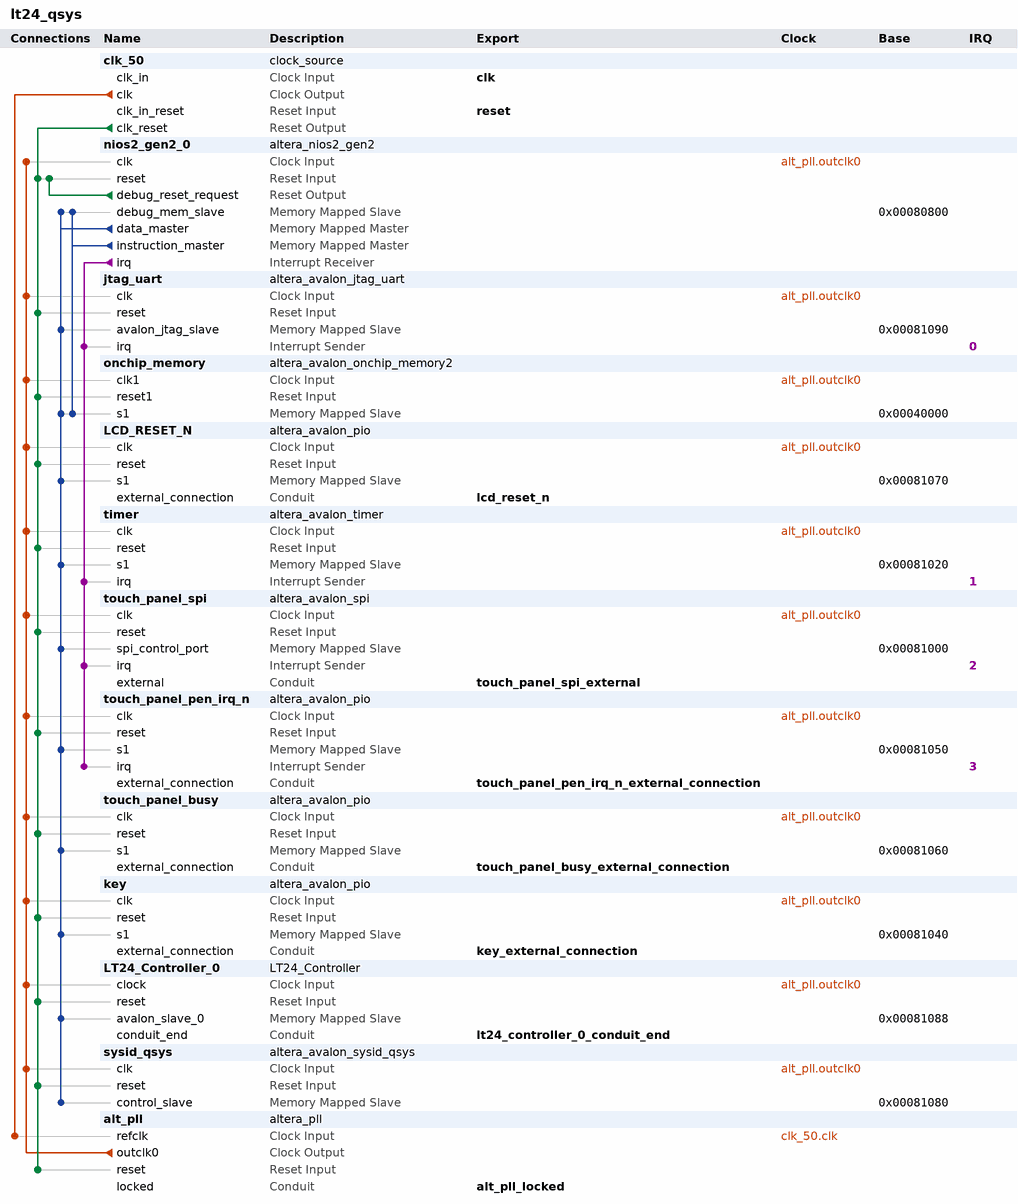
[diagram p0: system contents]
# Platform Designer (Qsys) system lt24_qsys, Cyclone V 5CSEMA4U23C6
# Parameters at their usual value, and those the tool derives, are not listed.
package require -exact qsys 14.1
create_system lt24_qsys
set_project_property DEVICE_FAMILY {Cyclone V}
set_project_property DEVICE 5CSEMA4U23C6

add_instance clk_50 clock_source 14.1
set_instance_parameter_value clk_50 clockFrequency 50000000

add_instance nios2_gen2_0 altera_nios2_gen2 14.1
set_instance_parameter_value nios2_gen2_0 dcache_size 2048
set_instance_parameter_value nios2_gen2_0 exceptionSlave onchip_memory.s1
set_instance_parameter_value nios2_gen2_0 icache_size 4096
set_instance_parameter_value nios2_gen2_0 impl Fast
set_instance_parameter_value nios2_gen2_0 resetSlave onchip_memory.s1

add_instance jtag_uart altera_avalon_jtag_uart 14.1
set_instance_parameter_value jtag_uart simInteractiveOptions INTERACTIVE_ASCII_OUTPUT

add_instance onchip_memory altera_avalon_onchip_memory2 14.1
set_instance_parameter_value onchip_memory dataWidth 32
set_instance_parameter_value onchip_memory dualPort false
set_instance_parameter_value onchip_memory initMemContent true
set_instance_parameter_value onchip_memory initializationFileName onchip_memory
set_instance_parameter_value onchip_memory memorySize 220000

add_instance LCD_RESET_N altera_avalon_pio 14.1
set_instance_parameter_value LCD_RESET_N direction Output
set_instance_parameter_value LCD_RESET_N width 1

add_instance timer altera_avalon_timer 14.1
set_instance_parameter_value timer period 1
set_instance_parameter_value timer periodUnits MSEC

add_instance touch_panel_spi altera_avalon_spi 14.1
set_instance_parameter_value touch_panel_spi clockPolarity 0
set_instance_parameter_value touch_panel_spi dataWidth 8
set_instance_parameter_value touch_panel_spi masterSPI true
set_instance_parameter_value touch_panel_spi numberOfSlaves 1
set_instance_parameter_value touch_panel_spi targetClockRate 32000

add_instance touch_panel_pen_irq_n altera_avalon_pio 14.1
set_instance_parameter_value touch_panel_pen_irq_n captureEdge true
set_instance_parameter_value touch_panel_pen_irq_n direction Input
set_instance_parameter_value touch_panel_pen_irq_n edgeType FALLING
set_instance_parameter_value touch_panel_pen_irq_n generateIRQ true
set_instance_parameter_value touch_panel_pen_irq_n irqType EDGE
set_instance_parameter_value touch_panel_pen_irq_n width 1

add_instance touch_panel_busy altera_avalon_pio 14.1
set_instance_parameter_value touch_panel_busy direction Input
set_instance_parameter_value touch_panel_busy width 1

add_instance key altera_avalon_pio 14.1
set_instance_parameter_value key direction Input
set_instance_parameter_value key width 4

add_instance LT24_Controller_0 LT24_Controller 1.0

add_instance sysid_qsys altera_avalon_sysid_qsys 14.1
set_instance_parameter_value sysid_qsys id 0

add_instance alt_pll altera_pll 14.1
set_instance_parameter_value alt_pll gui_device_speed_grade 2
set_instance_parameter_value alt_pll gui_number_of_clocks 1
set_instance_parameter_value alt_pll gui_operation_mode normal
set_instance_parameter_value alt_pll gui_output_clock_frequency0 150.0
set_instance_parameter_value alt_pll gui_pll_mode {Integer-N PLL}
set_instance_parameter_value alt_pll gui_reference_clock_frequency 50.0
set_instance_parameter_value alt_pll gui_use_locked true

# connections
add_connection alt_pll.outclk0 jtag_uart.clk clock
add_connection alt_pll.outclk0 key.clk clock
add_connection alt_pll.outclk0 LCD_RESET_N.clk clock
add_connection alt_pll.outclk0 LT24_Controller_0.clock clock
add_connection alt_pll.outclk0 nios2_gen2_0.clk clock
add_connection alt_pll.outclk0 onchip_memory.clk1 clock
add_connection alt_pll.outclk0 sysid_qsys.clk clock
add_connection alt_pll.outclk0 timer.clk clock
add_connection alt_pll.outclk0 touch_panel_busy.clk clock
add_connection alt_pll.outclk0 touch_panel_pen_irq_n.clk clock
add_connection alt_pll.outclk0 touch_panel_spi.clk clock
add_connection clk_50.clk alt_pll.refclk clock
add_connection clk_50.clk_reset alt_pll.reset reset
add_connection clk_50.clk_reset jtag_uart.reset reset
add_connection clk_50.clk_reset key.reset reset
add_connection clk_50.clk_reset LCD_RESET_N.reset reset
add_connection clk_50.clk_reset LT24_Controller_0.reset reset
add_connection clk_50.clk_reset nios2_gen2_0.reset reset
add_connection clk_50.clk_reset onchip_memory.reset1 reset
add_connection clk_50.clk_reset sysid_qsys.reset reset
add_connection clk_50.clk_reset timer.reset reset
add_connection clk_50.clk_reset touch_panel_busy.reset reset
add_connection clk_50.clk_reset touch_panel_pen_irq_n.reset reset
add_connection clk_50.clk_reset touch_panel_spi.reset reset
add_connection nios2_gen2_0.debug_reset_request nios2_gen2_0.reset reset
add_connection nios2_gen2_0.data_master jtag_uart.avalon_jtag_slave avalon
set_connection_parameter_value nios2_gen2_0.data_master/jtag_uart.avalon_jtag_slave baseAddress 0x00081090
add_connection nios2_gen2_0.data_master key.s1 avalon
set_connection_parameter_value nios2_gen2_0.data_master/key.s1 baseAddress 0x00081040
add_connection nios2_gen2_0.data_master LCD_RESET_N.s1 avalon
set_connection_parameter_value nios2_gen2_0.data_master/LCD_RESET_N.s1 baseAddress 0x00081070
add_connection nios2_gen2_0.data_master LT24_Controller_0.avalon_slave_0 avalon
set_connection_parameter_value nios2_gen2_0.data_master/LT24_Controller_0.avalon_slave_0 baseAddress 0x00081088
add_connection nios2_gen2_0.data_master nios2_gen2_0.debug_mem_slave avalon
set_connection_parameter_value nios2_gen2_0.data_master/nios2_gen2_0.debug_mem_slave baseAddress 0x00080800
add_connection nios2_gen2_0.data_master onchip_memory.s1 avalon
set_connection_parameter_value nios2_gen2_0.data_master/onchip_memory.s1 baseAddress 0x00040000
add_connection nios2_gen2_0.data_master sysid_qsys.control_slave avalon
set_connection_parameter_value nios2_gen2_0.data_master/sysid_qsys.control_slave baseAddress 0x00081080
add_connection nios2_gen2_0.data_master timer.s1 avalon
set_connection_parameter_value nios2_gen2_0.data_master/timer.s1 baseAddress 0x00081020
add_connection nios2_gen2_0.data_master touch_panel_busy.s1 avalon
set_connection_parameter_value nios2_gen2_0.data_master/touch_panel_busy.s1 baseAddress 0x00081060
add_connection nios2_gen2_0.data_master touch_panel_pen_irq_n.s1 avalon
set_connection_parameter_value nios2_gen2_0.data_master/touch_panel_pen_irq_n.s1 baseAddress 0x00081050
add_connection nios2_gen2_0.data_master touch_panel_spi.spi_control_port avalon
set_connection_parameter_value nios2_gen2_0.data_master/touch_panel_spi.spi_control_port baseAddress 0x00081000
add_connection nios2_gen2_0.instruction_master nios2_gen2_0.debug_mem_slave avalon
set_connection_parameter_value nios2_gen2_0.instruction_master/nios2_gen2_0.debug_mem_slave baseAddress 0x00080800
add_connection nios2_gen2_0.instruction_master onchip_memory.s1 avalon
set_connection_parameter_value nios2_gen2_0.instruction_master/onchip_memory.s1 baseAddress 0x00040000
add_connection nios2_gen2_0.irq jtag_uart.irq interrupt
set_connection_parameter_value nios2_gen2_0.irq/jtag_uart.irq irqNumber 0
add_connection nios2_gen2_0.irq timer.irq interrupt
set_connection_parameter_value nios2_gen2_0.irq/timer.irq irqNumber 1
add_connection nios2_gen2_0.irq touch_panel_pen_irq_n.irq interrupt
set_connection_parameter_value nios2_gen2_0.irq/touch_panel_pen_irq_n.irq irqNumber 3
add_connection nios2_gen2_0.irq touch_panel_spi.irq interrupt
set_connection_parameter_value nios2_gen2_0.irq/touch_panel_spi.irq irqNumber 2

# exported interfaces
add_interface alt_pll_locked conduit end
set_interface_property alt_pll_locked EXPORT_OF alt_pll.locked
add_interface clk clock sink
set_interface_property clk EXPORT_OF clk_50.clk_in
add_interface key_external_connection conduit end
set_interface_property key_external_connection EXPORT_OF key.external_connection
add_interface lcd_reset_n conduit end
set_interface_property lcd_reset_n EXPORT_OF LCD_RESET_N.external_connection
add_interface lt24_controller_0_conduit_end conduit end
set_interface_property lt24_controller_0_conduit_end EXPORT_OF LT24_Controller_0.conduit_end
add_interface reset reset sink
set_interface_property reset EXPORT_OF clk_50.clk_in_reset
add_interface touch_panel_busy_external_connection conduit end
set_interface_property touch_panel_busy_external_connection EXPORT_OF touch_panel_busy.external_connection
add_interface touch_panel_pen_irq_n_external_connection conduit end
set_interface_property touch_panel_pen_irq_n_external_connection EXPORT_OF touch_panel_pen_irq_n.external_connection
add_interface touch_panel_spi_external conduit end
set_interface_property touch_panel_spi_external EXPORT_OF touch_panel_spi.external

set_interconnect_requirement {$system} qsys_mm.clockCrossingAdapter HANDSHAKE
set_interconnect_requirement {$system} qsys_mm.maxAdditionalLatency 1

save_system lt24_qsys.qsys
